# EAGLE schematic OSO-MISC-20-010 (EAGLE 9.4.2)
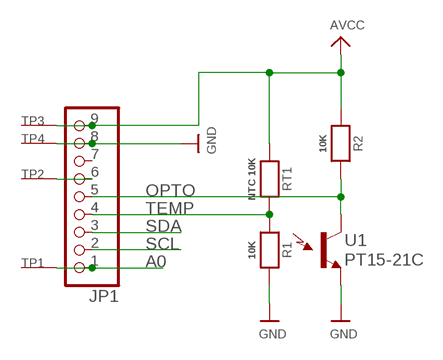
[diagram p0: schematic, sheet 1]

## Parts
JP1  HEADER-1X9_JSTSH  [JST_SH9]
R1  10K  RESISTOR0805_NOOUTLINE  [0805-NO]
R2  10K  RESISTOR0805_NOOUTLINE  [0805-NO]
RT1  NTC 10K  RESISTOR0805_NOOUTLINE  [0805-NO]
TP1  SEWTAP0.5IN  [SEWINGTAP_0.5]
TP2  SEWTAP0.5IN  [SEWINGTAP_0.5]
TP3  SEWTAP0.5IN  [SEWINGTAP_0.5]
TP4  SEWTAP0.5IN  [SEWINGTAP_0.5]
U1  PT15-21C  LIGHT_SENSOR1206  [LED-1206]

## Nets
A0: JP1.1 TP1.TAP(SEW)
AVCC [power]: JP1.9 R2.1 RT1.1 TP3.TAP(SEW)
GND: JP1.8 R1.2 TP4.TAP(SEW) U1.C(E1)
N$1: JP1.6 TP2.TAP(SEW)
OPTO: JP1.5 R2.2 U1.A(C1)
SCL: JP1.2
SDA: JP1.3
TEMP: JP1.4 R1.1 RT1.2
Unconnected: JP1.7

## Library data of the parts
JP1 = microbuilder:HEADER-1X9: PIN HEADER
R1 R2 RT1 = microbuilder:RESISTOR: Resistors For new designs, use the packages preceded by an '_' character since they are more reliable: The following footprints should be used on most boards: _0402 - Standard footprint for regular board layouts _0603 - Standard footprint for regular board layouts _0805 - Standard footprint for regular board layouts _1206 - Standard footprint for regular board layouts For extremely tight-pitch boards where space is at a premium, the following 'micro-pitch' footprints can be used (smaller pads, no silkscreen outline, etc.): _0402MP - Micro-pitch footprint for very dense/compact boards _0603MP - Micro-pitch footprint for very dense/compact boards _0805MP - Micro-pitch footprint for very dense/compact boards _1206MP - Micro-pitch footprint for very dense/compact boards
TP1-TP4 = adafruit:SEWTAP
U1 = SparkFun-Sensors:LIGHT_SENSOR: Ambient Light Sensors - Phototransistors Low cost ambient light sensors, consisting of a phototransistor in miniature SMD packages. Output voltage varies with light intensity. SparkFun Products ALS-PT19 Light Sensor <https://www.sparkfun.com/products/12566> (SEN-12566) Ambient Light Sensor - TEMT6000 <https://www.sparkfun.com/products/8348> (SEN-08348) SparkFun Ambient Light Sensor Breakout - TEMT60000 <https://www.sparkfun.com/products/8688> (SEN-08688)

## Net classes
0 default: width 0.152 mm, drill 0.254 mm
1 power: width 0.305 mm, drill 0.305 mm